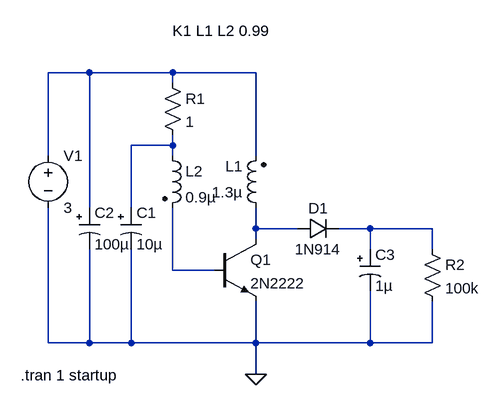
[diagram p0: schematic Draft1.asc]
Draft1.asc, the LTspice schematic file:
Version 4
SHEET 1 880 680
WIRE 16 -48 -48 -48
WIRE 144 -48 16 -48
WIRE 272 -48 144 -48
WIRE 144 -32 144 -48
WIRE 144 64 144 48
WIRE 144 64 80 64
WIRE -48 80 -48 -48
WIRE 144 80 144 64
WIRE 272 80 272 -48
WIRE 16 160 16 -48
WIRE 80 160 80 64
WIRE 272 192 272 160
WIRE 336 192 272 192
WIRE 448 192 400 192
WIRE 544 192 448 192
WIRE 272 208 272 192
WIRE 448 224 448 192
WIRE 544 224 544 192
WIRE 144 256 144 160
WIRE 208 256 144 256
WIRE -48 368 -48 160
WIRE 16 368 16 224
WIRE 16 368 -48 368
WIRE 80 368 80 224
WIRE 80 368 16 368
WIRE 272 368 272 304
WIRE 272 368 80 368
WIRE 448 368 448 288
WIRE 448 368 272 368
WIRE 544 368 544 304
WIRE 544 368 448 368
WIRE 272 416 272 368
FLAG 272 416 0
SYMBOL ind2 288 176 R180
WINDOW 0 36 80 Left 2
WINDOW 3 36 40 Left 2
SYMATTR InstName L1
SYMATTR Value 1.3µ
SYMATTR Type ind
SYMBOL ind2 128 64 R0
SYMATTR InstName L2
SYMATTR Value 0.9µ
SYMATTR Type ind
SYMBOL voltage -48 64 R0
WINDOW 123 0 0 Left 0
WINDOW 39 0 0 Left 0
SYMATTR InstName V1
SYMATTR Value 3
SYMBOL res 128 -48 R0
SYMATTR InstName R1
SYMATTR Value 1
SYMBOL npn2 208 208 R0
SYMATTR InstName Q1
SYMATTR Value 2N2222
SYMBOL polcap 64 160 R0
WINDOW 3 24 56 Left 2
SYMATTR InstName C1
SYMATTR Value 10µ
SYMATTR Description Capacitor
SYMATTR Type cap
SYMBOL polcap 0 160 R0
WINDOW 3 24 56 Left 2
SYMATTR InstName C2
SYMATTR Value 100µ
SYMATTR Description Capacitor
SYMATTR Type cap
SYMBOL diode 336 208 R270
WINDOW 0 32 32 VTop 2
WINDOW 3 0 32 VBottom 2
SYMATTR InstName D1
SYMATTR Value 1N914
SYMBOL res 528 208 R0
SYMATTR InstName R2
SYMATTR Value 100k
SYMBOL polcap 432 224 R0
WINDOW 3 24 56 Left 2
SYMATTR InstName C3
SYMATTR Value 1µ
SYMATTR Description Capacitor
SYMATTR Type cap
TEXT 144 -112 Left 2 !K1 L1 L2 0.99
TEXT -90 418 Left 2 !.tran 1 startup

The netlist it stands for:
* Draft1.asc
L1 N003 N001 1.3µ
L2 N002 N005 0.9µ
V1 N001 0 3
R1 N001 N002 1
Q1 N003 N005 0 0 2N2222
C1 N002 0 10µ
C2 N001 0 100µ
D1 N003 N004 1N914
R2 N004 0 100k
C3 N004 0 1µ
.model D D
.lib standard.dio
.model NPN NPN
.model PNP PNP
.lib standard.bjt
K1 L1 L2 0.99
.tran 1 startup
.backanno
.end